# EasyEDA schematic SCH_RemdesKVM_2025-04-20.json

## Sheets
1 KVM: TITLE: KVM Hub; REV: 1.0; Date: 2025-02-18; Sheet: 1/1; Drawn By: tobychui; Company: RemdesKVM
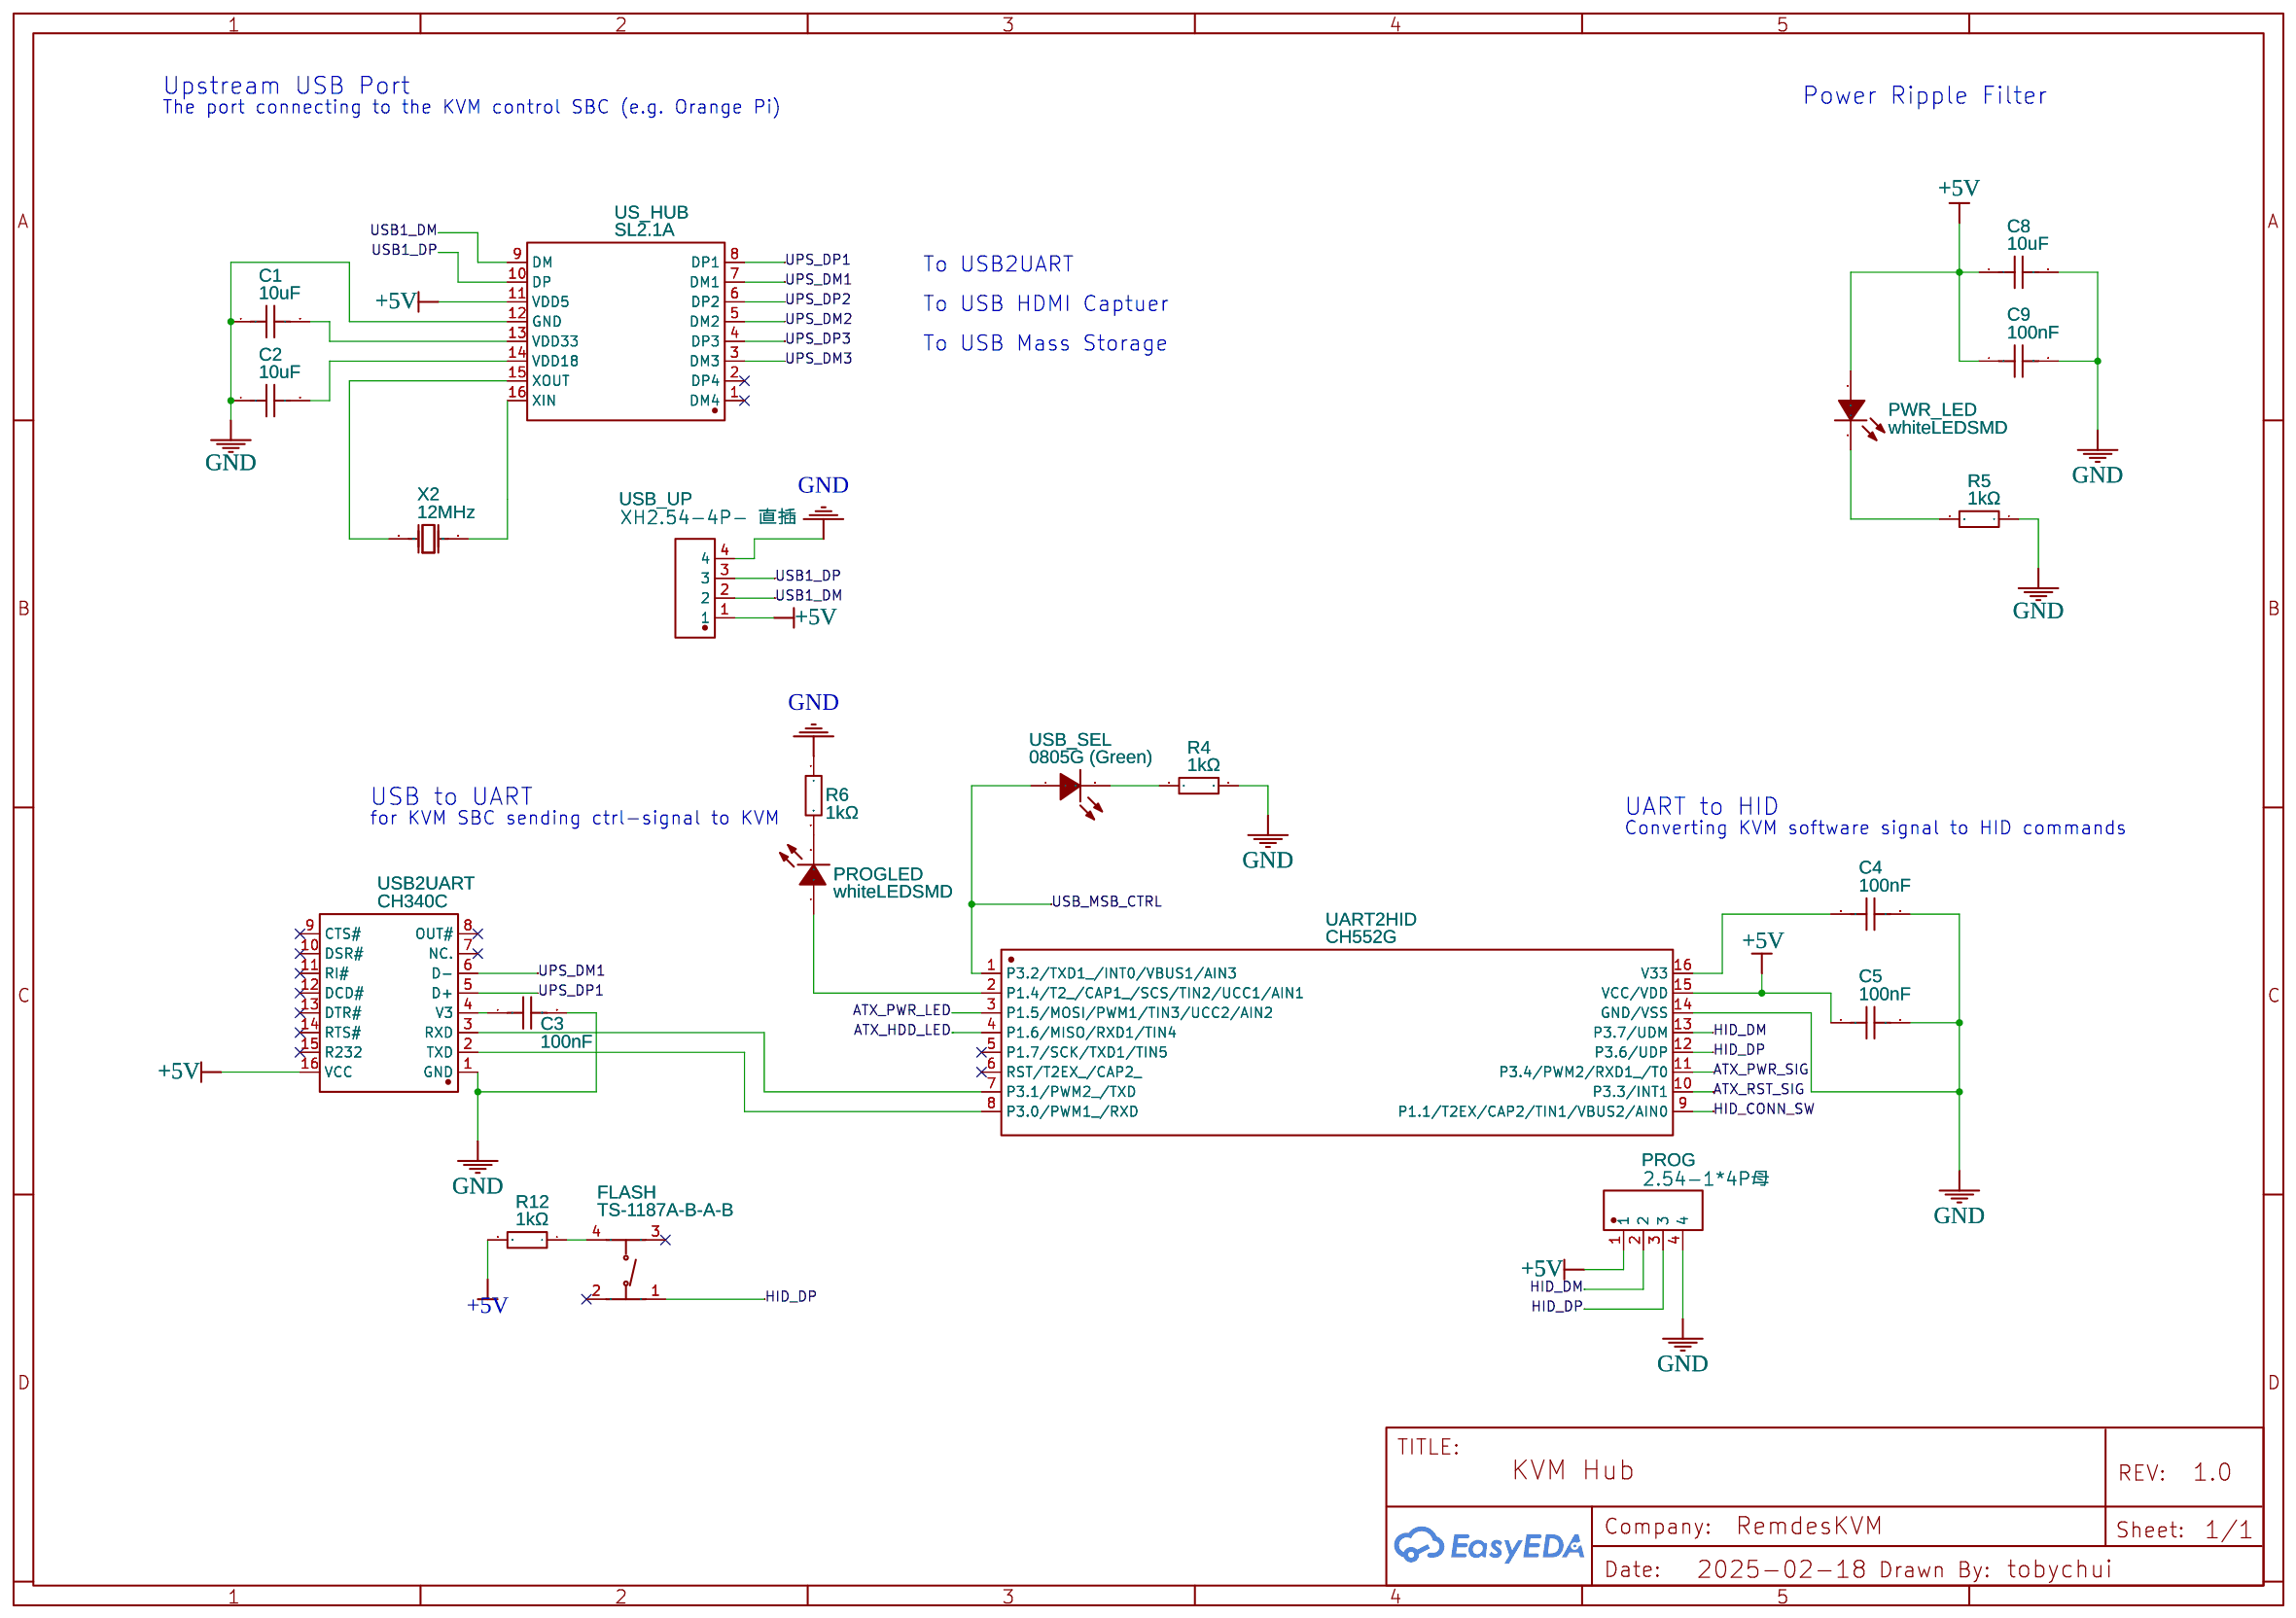
[diagram p0: KVM]
2 Guest: TITLE: Guest Side; Date: 2025-02-20; Company: imuslab
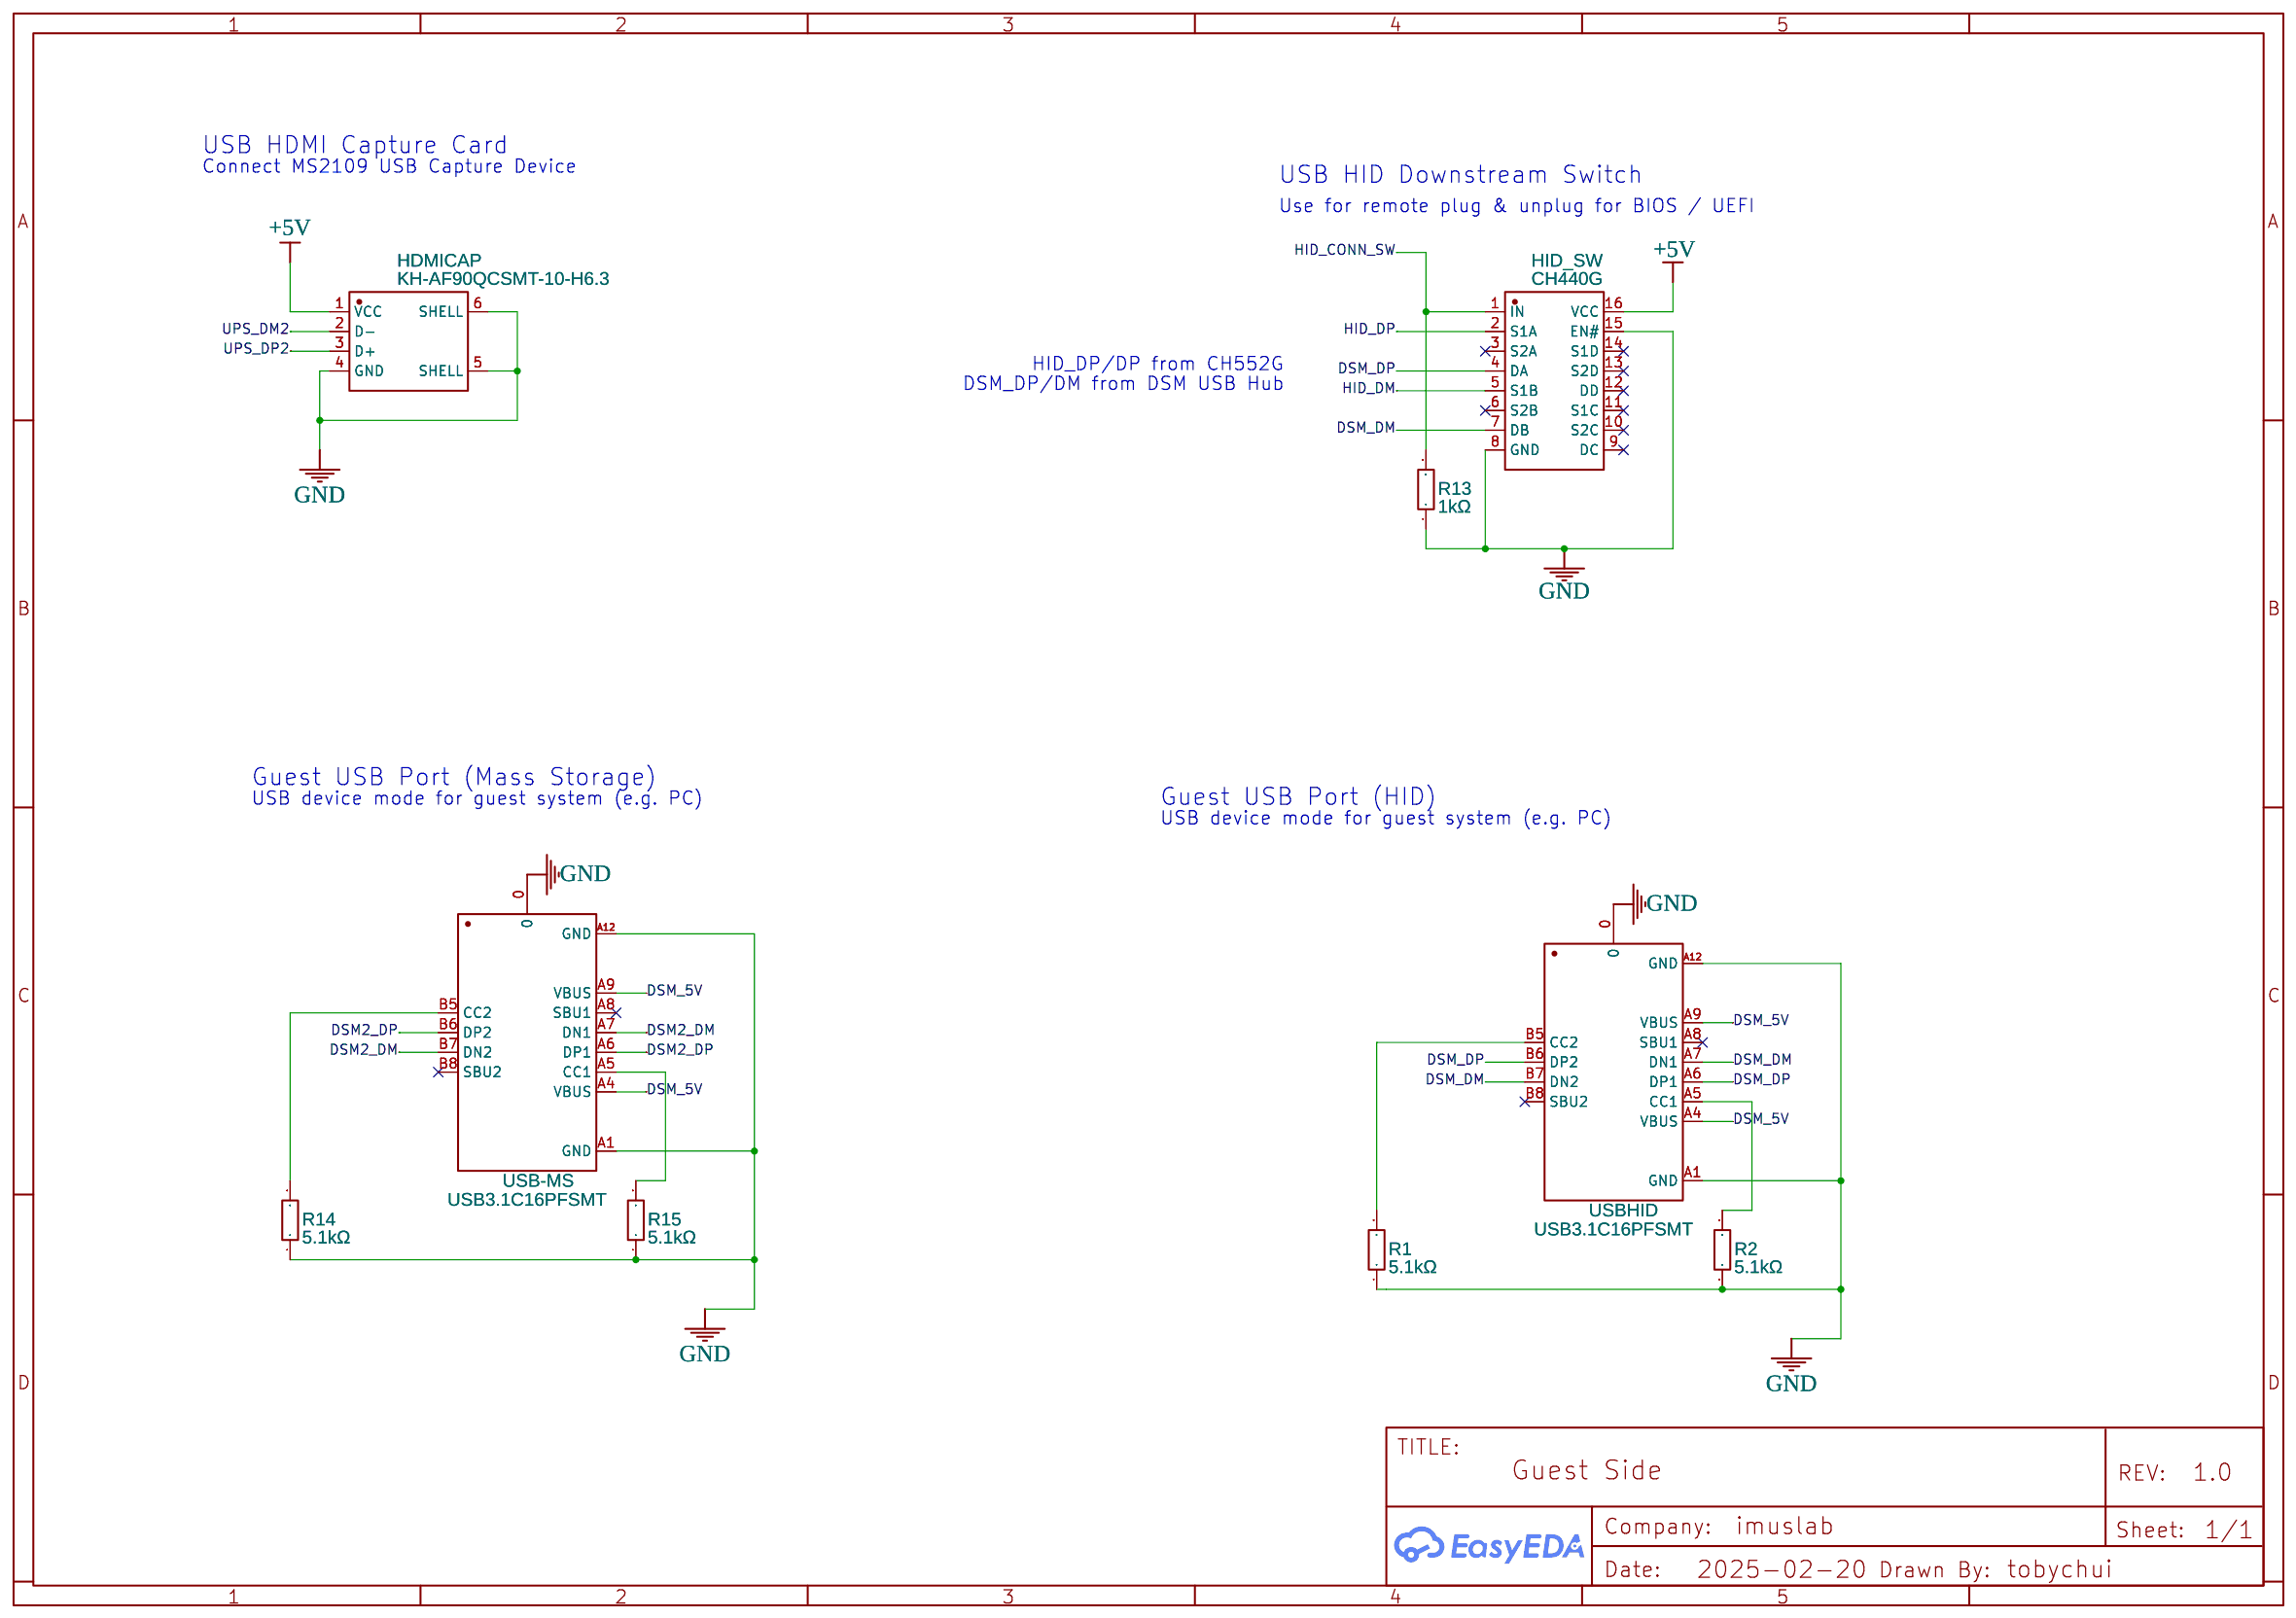
[diagram p1: Guest]
3 USB Mass Storage: TITLE: USB Mass Storage; Date: 2025-03-30; Company: imuslab
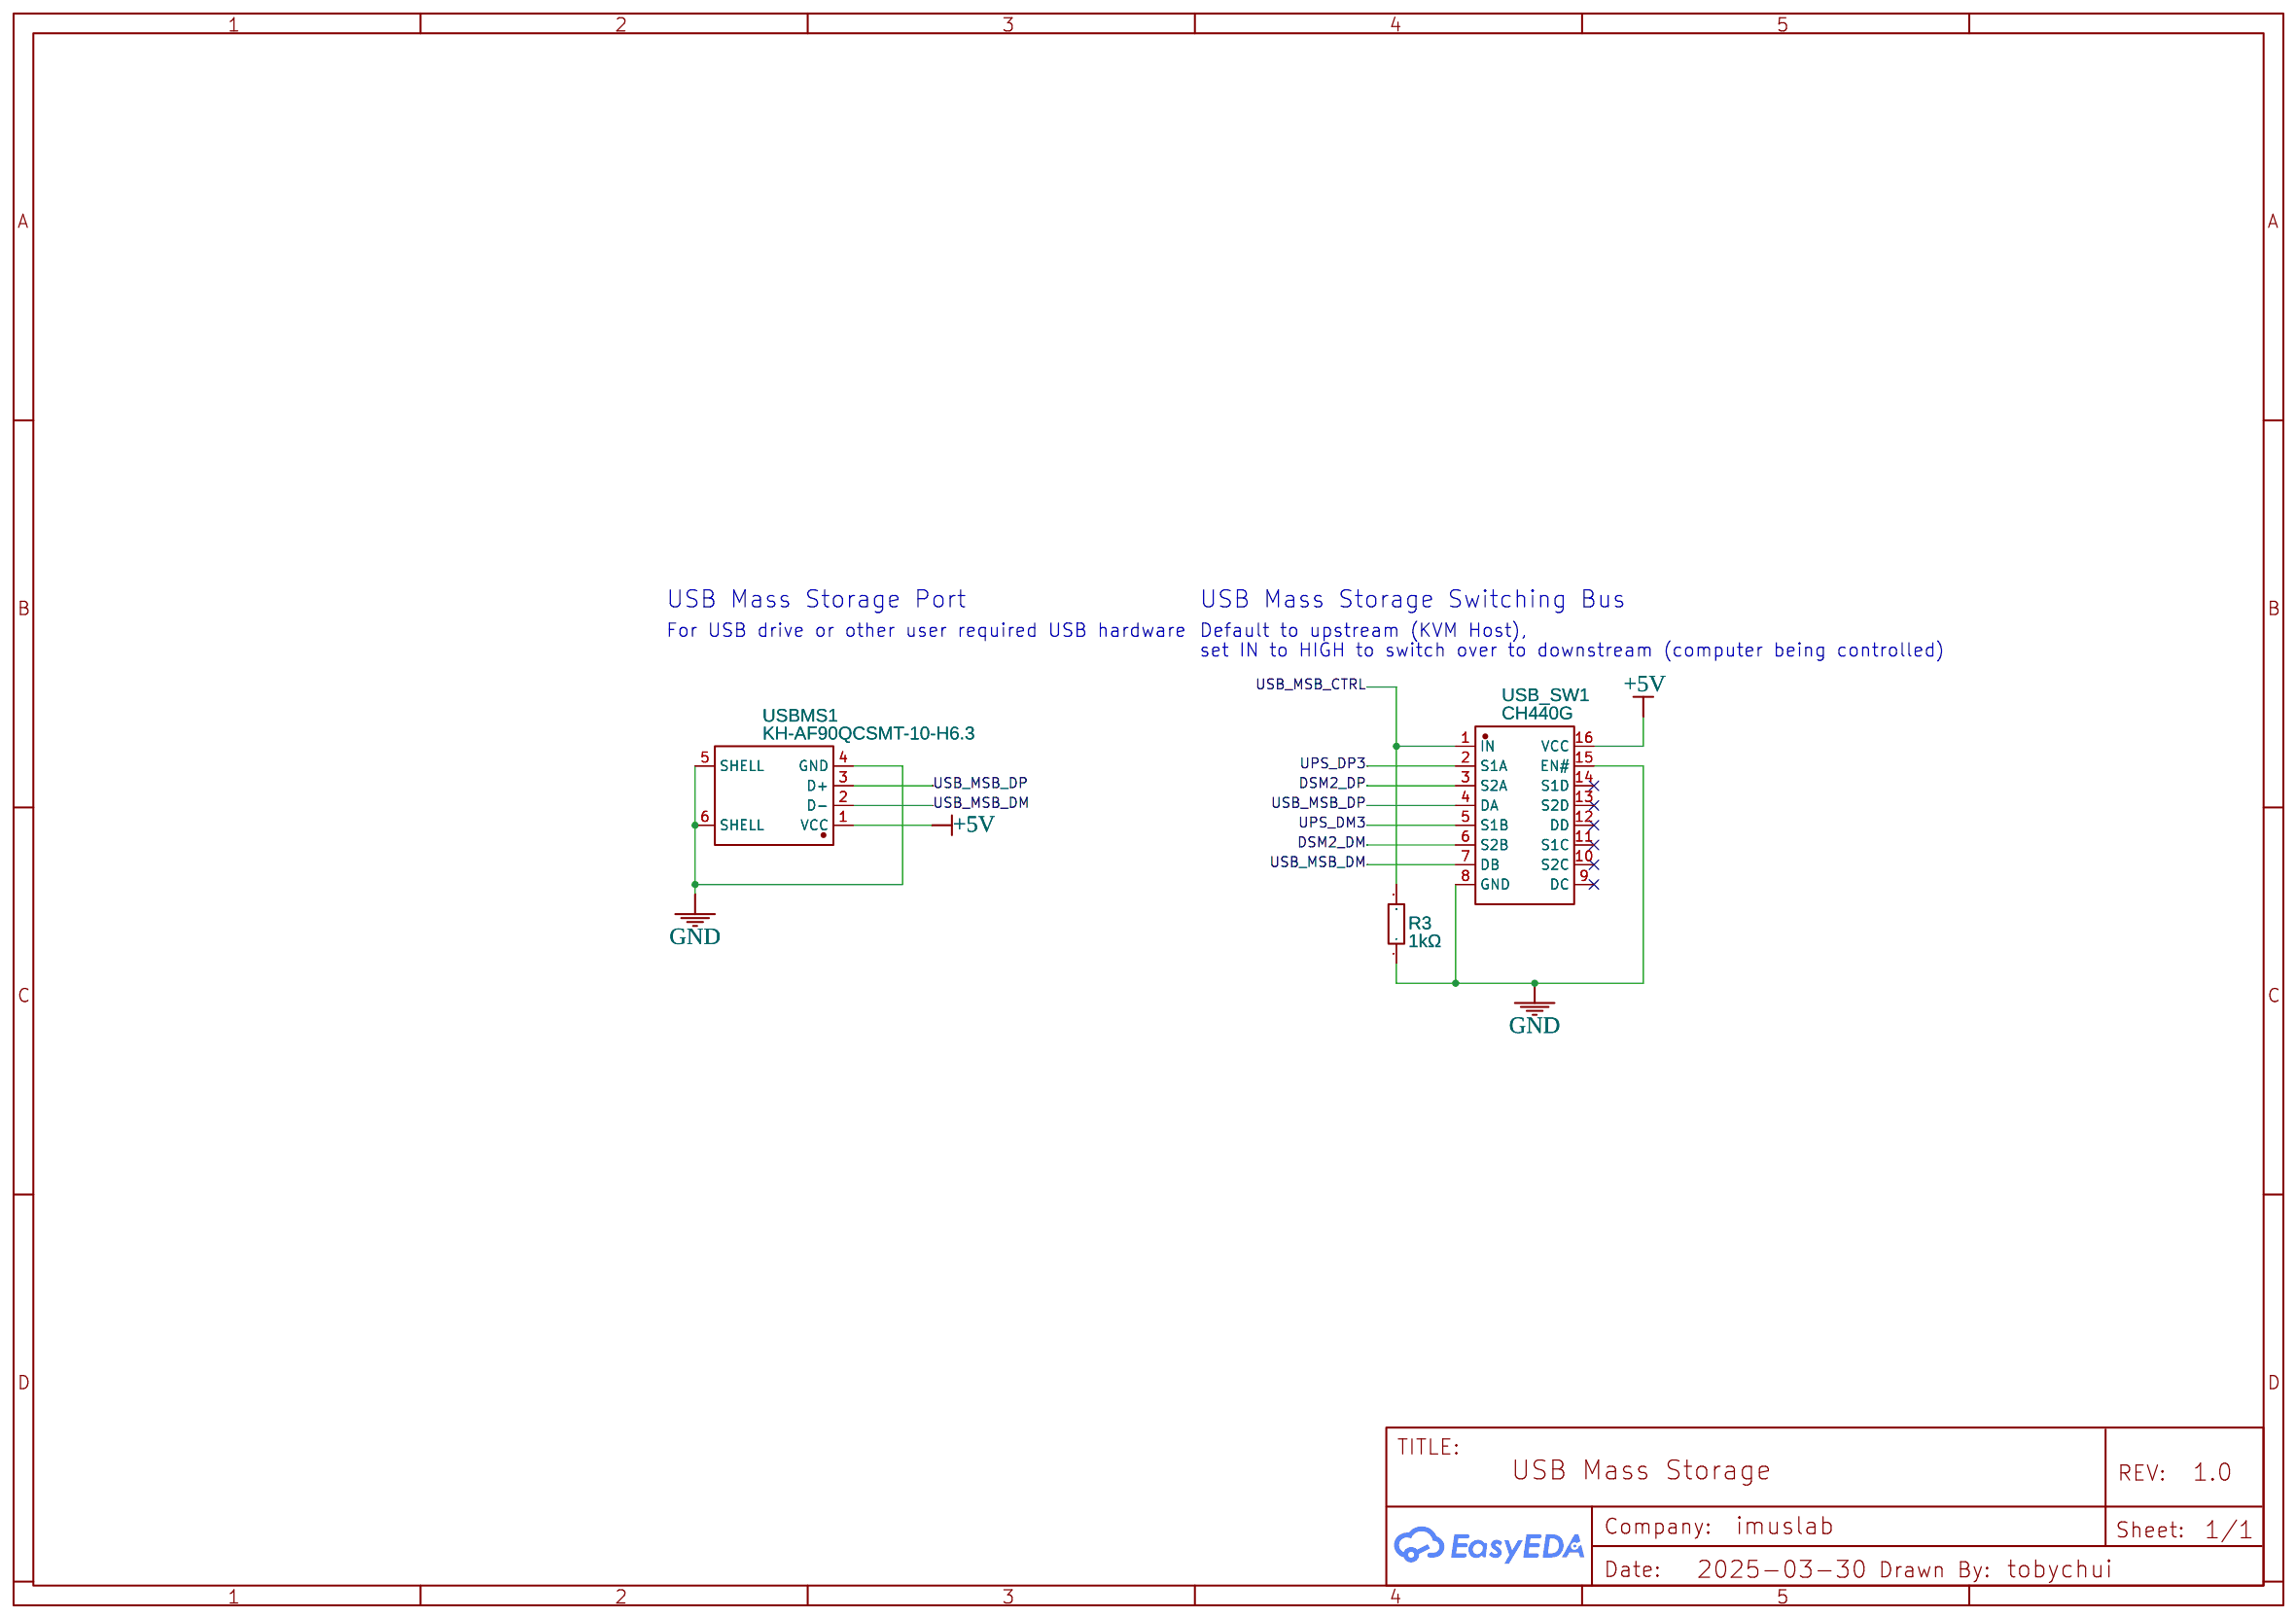
[diagram p2: USB Mass Storage]
4 ATX: TITLE: ATX Rev2; Date: 2025-04-20; Company: imuslab
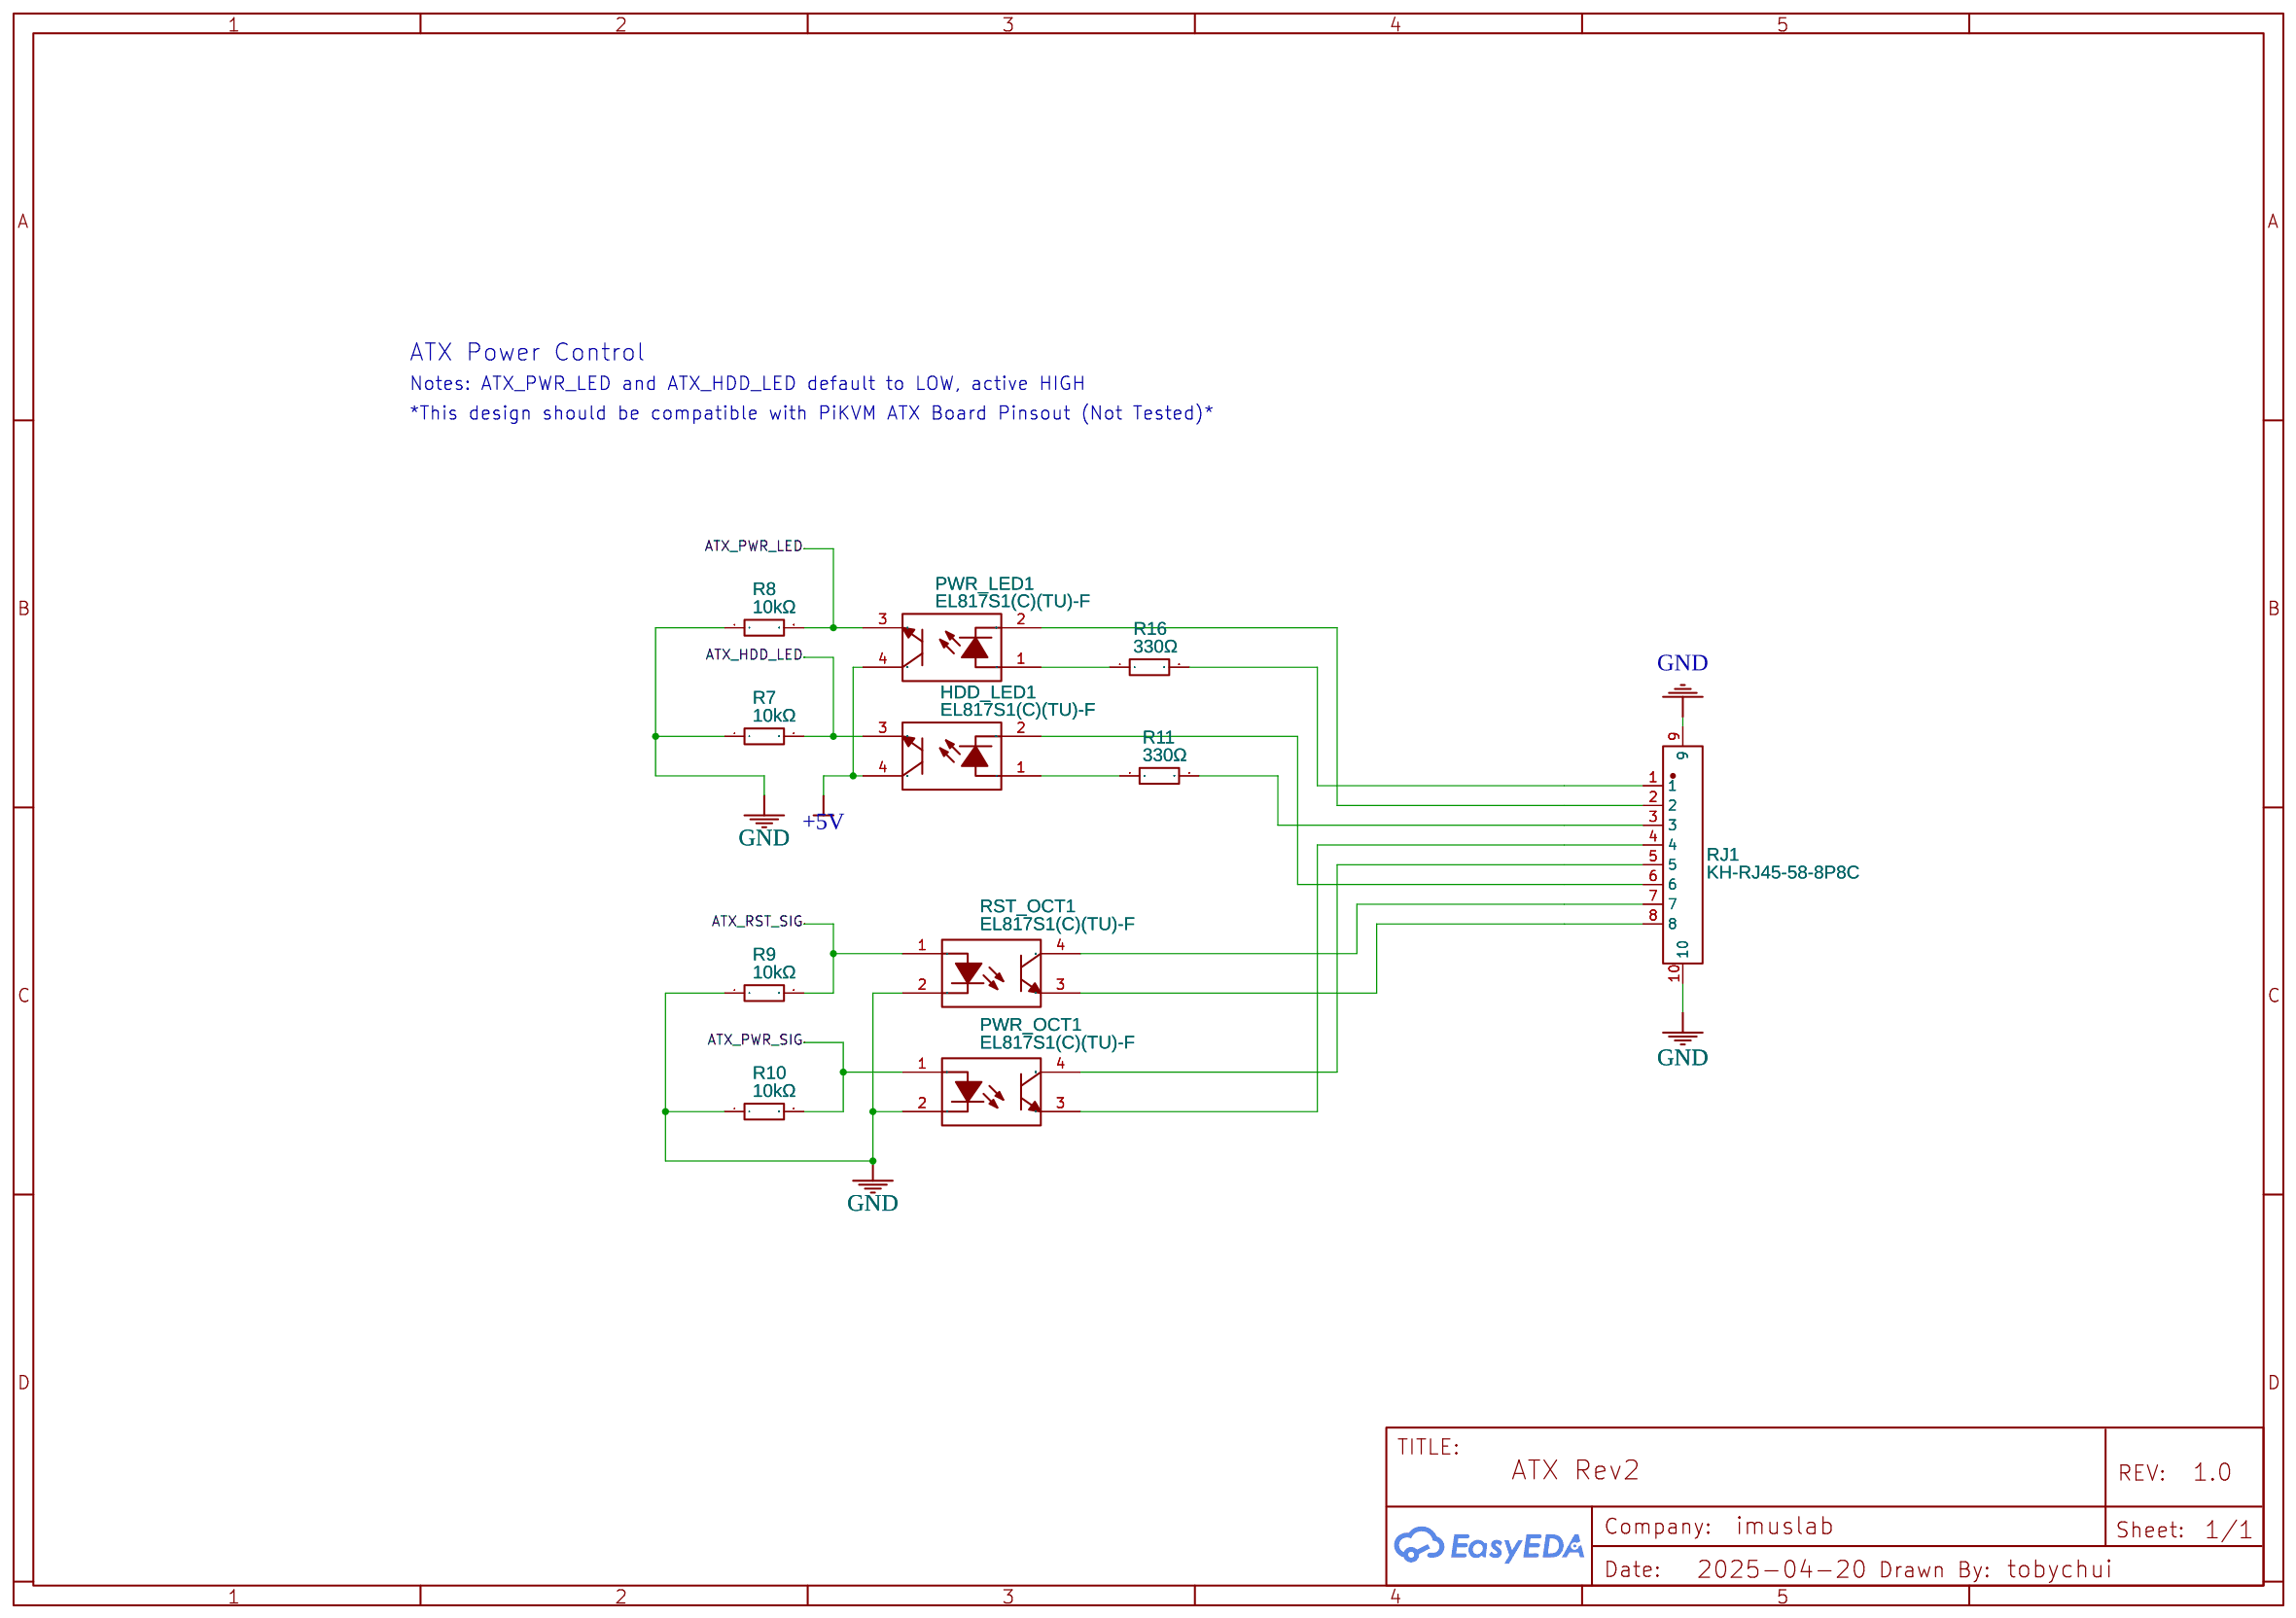
[diagram p3: ATX]

## Parts
sheet ATX
HDD_LED1  EL817S1(C)(TU)-F  [OPTO-SMD-4_L4.6-W6.5-P2.54-LS10.3-TL]
PWR_LED1  EL817S1(C)(TU)-F  [OPTO-SMD-4_L4.6-W6.5-P2.54-LS10.3-TL]
PWR_OCT1  EL817S1(C)(TU)-F  [OPTO-SMD-4_L4.6-W6.5-P2.54-LS10.3-TL]
R7  10kΩ  [R0805]
R8  10kΩ  [R0805]
R9  10kΩ  [R0805]
R10  10kΩ  [R0805]
R11  330Ω  [R0805]
R16  330Ω  [R0805]
RJ1  KH-RJ45-58-8P8C  [RJ45-TH_KH-RJ45-58-8P8C]
RST_OCT1  EL817S1(C)(TU)-F  [OPTO-SMD-4_L4.6-W6.5-P2.54-LS10.3-TL]
sheet Guest
HDMICAP  KH-AF90QCSMT-10-H6.3  [USB-A-SMD_KH-AF90QCSMT-10-H6.3]
HID_SW  CH440G  [SOP-16_L10.0-W3.9-P1.27-LS6.0-BL]
R1  5.1kΩ  [R0805]
R2  5.1kΩ  [R0805]
R13  1kΩ  [R0805]
R14  5.1kΩ  [R0805]
R15  5.1kΩ  [R0805]
USB-MS  USB3.1C16PFSMT  [USB-C-SMD_TYPE-C-USB-17]
USBHID  USB3.1C16PFSMT  [USB-C-SMD_TYPE-C-USB-17]
sheet KVM
C1  10uF  [C0805]
C2  10uF  [C0805]
C3  100nF  [C0805]
C4  100nF  [C0805]
C5  100nF  [C0805]
C8  10uF  [C0805]
C9  100nF  [C0805]
FLASH  TS-1187A-B-A-B  [SW-SMD_4P-L5.1-W5.1-P3.70-LS6.5-TL_H1.5]
PROG  2.54-1*4P母  [HDR-TH_4P-P2.54-V-F]
PROGLED  whiteLEDSMD  [LED0805-R-RD]
PWR_LED  whiteLEDSMD  [LED0805-R-RD]
R4  1kΩ  [R0805]
R5  1kΩ  [R0805]
R6  1kΩ  [R0805]
R12  1kΩ  [R0805]
UART2HID  CH552G  [SOP-16_L10.0-W3.9-P1.27-LS6.0-BL]
US_HUB  SL2.1A  [SOP-16_L10.0-W3.9-P1.27-LS6.0-BL]
USB2UART  CH340C  [SOP-16_L10.0-W3.9-P1.27-LS6.0-BL]
USB_SEL  0805G (Green)  [LED0805-R-RD]
USB_UP  XH2.54-4P- 直插  [CONN-TH_4P-P2.50-XH2.54-4P]
X2  12MHz  [OSC-SMD_L5.0-W3.2]
sheet USB Mass Storage
R3  1kΩ  [R0805]
USB_SW1  CH440G  [SOP-16_L10.0-W3.9-P1.27-LS6.0-BL]
USBMS1  KH-AF90QCSMT-10-H6.3  [USB-A-SMD_KH-AF90QCSMT-10-H6.3]

## Library data of the parts
HDD_LED1 PWR_LED1 PWR_OCT1 RST_OCT1 = EL817S1(C)(TU)-F: Supplier: LCSC; Manufacturer: EVERLIGHT(亿光); Supplier Part: C106900; JLCPCB Part Class: Basic Part
R7-R10 = 0805W8F1002T5E: Supplier: LCSC; Manufacturer: UNI-ROYAL(厚声); Supplier Part: C17414; JLCPCB Part Class: Basic Part
R11 R16 = 0805W8F3300T5E: Supplier: LCSC; Manufacturer: UNI-ROYAL(厚声); Supplier Part: C17630; JLCPCB Part Class: Basic Part
RJ1 = KH-RJ45-58-8P8C: Contributor: LCSC; Supplier: LCSC; Supplier Part: C2683360; Manufacturer: kinghelm(金航标); JLCPCB Part Class: Extended Part
HDMICAP USBMS1 = KH-AF90QCSMT-10-H6.3: Contributor: lcsc; Supplier: LCSC; Supplier Part: C2979063; Manufacturer: kinghelm(金航标); JLCPCB Part Class: Extended Part
HID_SW USB_SW1 = CH440G: Supplier: LCSC; Manufacturer: WCH(南京沁恒); Supplier Part: C88324; JLCPCB Part Class: Extended Part
R1 R2 R14 R15 = 0805W8F5101T5E: Supplier: LCSC; Manufacturer: UNI-ROYAL(厚声); Supplier Part: C27834; JLCPCB Part Class: Basic Part
R3-R6 R12 R13 = 0805W8F1001T5E: Supplier: LCSC; Manufacturer: UNI-ROYAL(厚声); Supplier Part: C17513; JLCPCB Part Class: Basic Part
USB-MS USBHID = USB3.1C16PFSMT: Contributor: LCSC; Supplier: LCSC; Supplier Part: C167321; Manufacturer: 精拓金; Manufacturer Part: 918-418K2023S40001; JLCPCB Part Class: Extended Part
C1 C2 C8 = CL21A106KAYNNNE: Supplier: LCSC; Manufacturer: SAMSUNG(三星); Supplier Part: C15850; JLCPCB Part Class: Basic Part
C3-C5 C9 = CC0805KRX7R9BB104: Supplier: LCSC; Manufacturer: YAGEO(国巨); Supplier Part: C49678; JLCPCB Part Class: Basic Part
FLASH = TS-1187A-B-A-B: Contributor: LCSC; Supplier: LCSC; Supplier Part: C318884; Manufacturer: XKB Connectivity(中国星坤); JLCPCB Part Class: Basic Part
PROG = 2.54-1*4P母: Contributor: LCSC; Supplier: LCSC; Supplier Part: C2718488; Manufacturer: BOOMELE(博穆精密); JLCPCB Part Class: Extended Part
PROGLED PWR_LED = whiteLEDSMD: Supplier: LCSC; Manufacturer: KENTO; Manufacturer Part: KT-0805W; Supplier Part: C34499; JLCPCB Part Class: Basic Part
UART2HID = CH552G: Supplier: LCSC; Manufacturer: WCH(南京沁恒); Supplier Part: C111292; JLCPCB Part Class: Extended Part
US_HUB = SL2.1A: Contributor: LCSC; Supplier: LCSC; Supplier Part: C192893; Manufacturer: CoreChips(和芯润德); JLCPCB Part Class: Extended Part
USB2UART = CH340C: Supplier: LCSC; Manufacturer: WCH(南京沁恒); Supplier Part: C84681; JLCPCB Part Class: Extended Part
USB_SEL = 0805G (Green): Supplier: LCSC; Manufacturer: KENTO; Manufacturer Part: KT-0805G; Supplier Part: C2297; JLCPCB Part Class: Basic Part
USB_UP = XH2.54-4P- 直插: Contributor: LCSC; Supplier: LCSC; Supplier Part: C9900000103; Manufacturer: null; JLCPCB Part Class: Extended Part
X2 = X503212MSD2GI: Supplier: LCSC; Manufacturer: YXC(扬兴晶振); Supplier Part: C114436; JLCPCB Part Class: Extended Part

## Nets
+5V: C5.1 C8.1 C9.1 HDD_LED1.4(COL) HDMICAP.1(VCC) HID_SW.16(VCC) PROG.1 PWR_LED.1(A) PWR_LED1.4(COL) R12.2 UART2HID.15(VCC/VDD) US_HUB.11(VDD5) USB2UART.16(VCC) USB_SW1.16(VCC) USB_UP.1 USBMS1.1(VCC)
GND: C1.1 C2.1 C3.2 C4.2 C5.2 C8.2 C9.2 HDMICAP.4(GND) HDMICAP.5(SHELL) HDMICAP.6(SHELL) HID_SW.8(GND) HID_SW.15(EN#) PROG.4 PWR_OCT1.2(CAT) R1.1 R2.1 R3.1 R4.1 R5.1 R6.1 R7.1 R8.1 R9.1 R10.1 R13.1 R14.1 R15.1 RJ1.9 RJ1.10 RST_OCT1.2(CAT) UART2HID.14(GND/VSS) US_HUB.12(GND) USB2UART.1(GND) USB-MS.0 USB-MS.A1(GND) USB-MS.A12(GND) USB_SW1.8(GND) USB_SW1.15(EN#) USB_UP.4 USBHID.0 USBHID.A1(GND) USBHID.A12(GND) USBMS1.4(GND) USBMS1.5(SHELL) USBMS1.6(SHELL)
ATX_HDD_LED: HDD_LED1.3(EM) R7.2 UART2HID.4(P1.6/MISO/RXD1/TIN4)
ATX_PWR_LED: PWR_LED1.3(EM) R8.2 UART2HID.3(P1.5/MOSI/PWM1/TIN3/UCC2/AIN2)
ATX_PWR_SIG: PWR_OCT1.1(AN) R10.2 UART2HID.11(P3.4/PWM2/RXD1_/T0)
ATX_RST_SIG: R9.2 RST_OCT1.1(AN) UART2HID.10(P3.3/INT1)
DSM2_DM: USB-MS.A7(DN1) USB-MS.B7(DN2) USB_SW1.6(S2B)
DSM2_DP: USB-MS.A6(DP1) USB-MS.B6(DP2) USB_SW1.3(S2A)
DSM_5V: USB-MS.A4(VBUS) USB-MS.A9(VBUS) USBHID.A4(VBUS) USBHID.A9(VBUS)
DSM_DM: HID_SW.7(DB) USBHID.A7(DN1) USBHID.B7(DN2)
DSM_DP: HID_SW.4(DA) USBHID.A6(DP1) USBHID.B6(DP2)
HID_CONN_SW: HID_SW.1(IN) R13.2 UART2HID.9(P1.1/T2EX/CAP2/TIN1/VBUS2/AIN0)
HID_DM: HID_SW.5(S1B) PROG.2 UART2HID.13(P3.7/UDM)
HID_DP: FLASH.1(A) HID_SW.2(S1A) PROG.3 UART2HID.12(P3.6/UDP)
UPS_DM1: US_HUB.7(DM1) USB2UART.6(D-)
UPS_DM2: HDMICAP.2(D-) US_HUB.5(DM2)
UPS_DM3: US_HUB.3(DM3) USB_SW1.5(S1B)
UPS_DP1: US_HUB.8(DP1) USB2UART.5(D+)
UPS_DP2: HDMICAP.3(D+) US_HUB.6(DP2)
UPS_DP3: US_HUB.4(DP3) USB_SW1.2(S1A)
USB1_DM: US_HUB.9(DM) USB_UP.2
USB1_DP: US_HUB.10(DP) USB_UP.3
USB_MSB_CTRL: R3.2 UART2HID.1(P3.2/TXD1_/INT0/VBUS1/AIN3) USB_SEL.1(A) USB_SW1.1(IN)
USB_MSB_DM: USB_SW1.7(DB) USBMS1.2(D-)
USB_MSB_DP: USB_SW1.4(DA) USBMS1.3(D+)
Net-(C1-2): C1.2 US_HUB.13(VDD33)
Net-(C2-2): C2.2 US_HUB.14(VDD18)
Net-(C3-1): C3.1 USB2UART.4(V3)
Net-(C4-1): C4.1 UART2HID.16(V33)
Net-(FLASH-4): FLASH.4(D) R12.1
Net-(HDD_LED1-1): HDD_LED1.1(AN) R11.1
Net-(HDD_LED1-2): HDD_LED1.2(CAT) RJ1.6
Net-(PROGLED-1): PROGLED.1(A) UART2HID.2(P1.4/T2_/CAP1_/SCS/TIN2/UCC1/AIN1)
Net-(PROGLED-2): PROGLED.2(K) R6.2
Net-(PWR_LED1-1): PWR_LED1.1(AN) R16.1
Net-(PWR_LED1-2): PWR_LED1.2(CAT) RJ1.2
Net-(PWR_LED-2): PWR_LED.2(K) R5.2
Net-(PWR_OCT1-3): PWR_OCT1.3(EM) RJ1.4
Net-(PWR_OCT1-4): PWR_OCT1.4(COL) RJ1.5
Net-(R1-2): R1.2 USBHID.B5(CC2)
Net-(R2-2): R2.2 USBHID.A5(CC1)
Net-(R4-2): R4.2 USB_SEL.2(K)
Net-(R11-2): R11.2 RJ1.3
Net-(R14-2): R14.2 USB-MS.B5(CC2)
Net-(R15-2): R15.2 USB-MS.A5(CC1)
Net-(R16-2): R16.2 RJ1.1
Net-(RJ1-7): RJ1.7 RST_OCT1.4(COL)
Net-(RJ1-8): RJ1.8 RST_OCT1.3(EM)
Net-(UART2HID-7): UART2HID.7(P3.1/PWM2_/TXD) USB2UART.3(RXD)
Net-(UART2HID-8): UART2HID.8(P3.0/PWM1_/RXD) USB2UART.2(TXD)
Net-(US_HUB-15): US_HUB.15(XOUT) X2.1(OSC1)
Net-(US_HUB-16): US_HUB.16(XIN) X2.2(OSC2)

Not connected (* = marked no-connect by the designer): FLASH 2(B)* 3(C)*; HID_SW 3(S2A)* 6(S2B)* 9(DC)* 10(S2C)* 11(S1C)* 12(DD)* 13(S2D)* 14(S1D)*; UART2HID 5(P1.7/SCK/TXD1/TIN5)* 6(RST/T2EX_/CAP2_)*; US_HUB 1(DM4)* 2(DP4)*; USB2UART 7(NC.)* 8(OUT#)* 9(CTS#)* 10(DSR#)* 11(RI#)* 12(DCD#)* 13(DTR#)* 14(RTS#)* 15(R232)*; USB-MS A8(SBU1)* B8(SBU2)*; USB_SW1 9(DC)* 10(S2C)* 11(S1C)* 12(DD)* 13(S2D)* 14(S1D)*; USBHID A8(SBU1)* B8(SBU2)*

## Notes on the sheets
sheet 1
- Upstream USB Port
- Power Ripple Filter
- The port connecting to the KVM control SBC (e.g. Orange Pi)
- To USB2UART
- To USB HDMI Captuer
- To USB Mass Storage
- USB to UART
- for KVM SBC sending ctrl-signal to KVM
- UART to HID
- Converting KVM software signal to HID commands
sheet 2
- USB HDMI Capture Card
- Connect MS2109 USB Capture Device
- USB HID Downstream Switch
- Use for remote plug & unplug for BIOS / UEFI
- HID_DP/DP from CH552G
- DSM_DP/DM from DSM USB Hub
- Guest USB Port (Mass Storage)
- USB device mode for guest system (e.g. PC)
- Guest USB Port (HID)
- USB device mode for guest system (e.g. PC)
sheet 3
- USB Mass Storage Port
- USB Mass Storage Switching Bus
- For USB drive or other user required USB hardware
- Default to upstream (KVM Host),
- set IN to HIGH to switch over to downstream (computer being controlled)
sheet 4
- ATX Power Control
- Notes: ATX_PWR_LED and ATX_HDD_LED default to LOW, active HIGH
- *This design should be compatible with PiKVM ATX Board Pinsout (Not Tested)*
